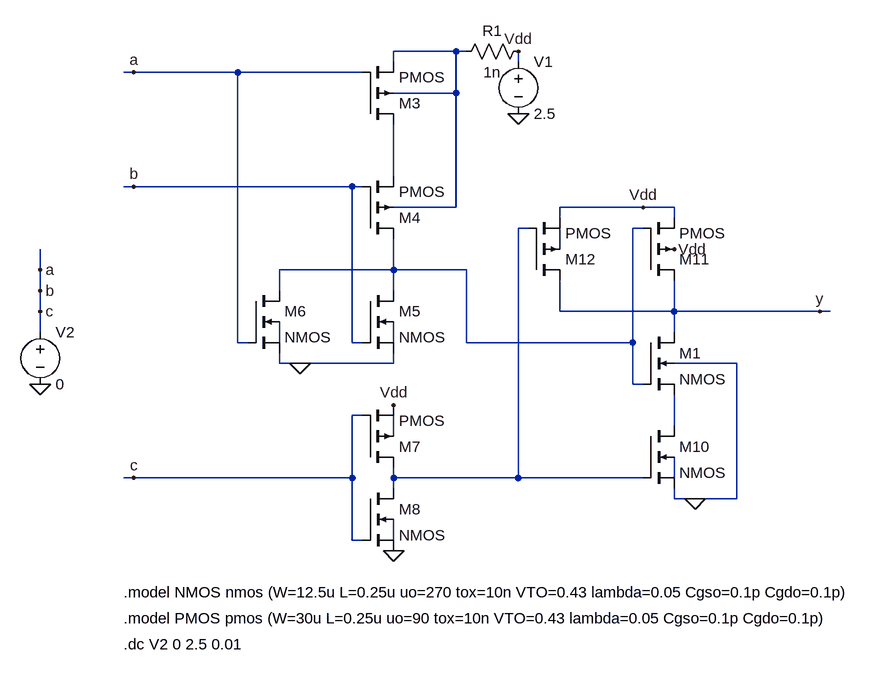
[diagram p0: schematic 1.asc]
1.asc, the LTspice schematic file:
Version 4
SHEET 1 880 680
WIRE -16 -304 -112 -304
WIRE 0 -304 -16 -304
WIRE -112 -288 -112 -304
WIRE 80 -288 80 -304
WIRE -512 -272 -528 -272
WIRE -352 -272 -512 -272
WIRE -160 -272 -352 -272
WIRE -16 -240 -16 -304
WIRE -16 -240 -112 -240
WIRE -112 -112 -112 -192
WIRE -512 -96 -528 -96
WIRE -176 -96 -512 -96
WIRE -160 -96 -176 -96
WIRE -16 -64 -16 -240
WIRE -16 -64 -112 -64
WIRE 272 -64 144 -64
WIRE 320 -64 272 -64
WIRE 144 -48 144 -64
WIRE 320 -48 320 -64
WIRE 96 -32 80 -32
WIRE 272 -32 256 -32
WIRE 144 0 144 -32
WIRE -656 32 -656 0
WIRE -112 32 -112 -16
WIRE -112 32 -288 32
WIRE 0 32 -112 32
WIRE -656 64 -656 32
WIRE -288 64 -288 32
WIRE -112 64 -112 32
WIRE -656 96 -656 64
WIRE 144 96 144 48
WIRE 320 96 320 48
WIRE 320 96 144 96
WIRE 544 96 320 96
WIRE 560 96 544 96
WIRE -656 128 -656 96
WIRE 320 128 320 96
WIRE -352 144 -352 -272
WIRE -336 144 -352 144
WIRE -288 144 -288 112
WIRE -176 144 -176 -96
WIRE -160 144 -176 144
WIRE -112 144 -112 112
WIRE 0 144 0 32
WIRE 256 144 256 -32
WIRE 256 144 0 144
WIRE -288 176 -288 160
WIRE -256 176 -288 176
WIRE -112 176 -112 160
WIRE -112 176 -256 176
WIRE 416 176 320 176
WIRE 256 208 256 144
WIRE 272 208 256 208
WIRE -160 256 -176 256
WIRE 320 272 320 224
WIRE -112 288 -112 256
WIRE -512 352 -528 352
WIRE -176 352 -176 256
WIRE -176 352 -512 352
WIRE -112 352 -112 336
WIRE 80 352 80 -32
WIRE 80 352 -112 352
WIRE 272 352 80 352
WIRE 320 352 320 320
WIRE -112 368 -112 352
WIRE 320 384 320 368
WIRE 352 384 320 384
WIRE 416 384 416 176
WIRE 416 384 352 384
WIRE -176 448 -176 352
WIRE -160 448 -176 448
WIRE -112 448 -112 416
FLAG 80 -208 0
FLAG -256 176 0
FLAG 80 -304 Vdd
FLAG -112 240 Vdd
FLAG -112 464 0
FLAG 272 -64 Vdd
FLAG -512 -272 a
FLAG -512 -96 b
FLAG -512 352 c
FLAG 544 96 y
FLAG -656 96 c
FLAG -656 64 b
FLAG -656 208 0
FLAG 320 0 Vdd
FLAG 352 384 0
FLAG -656 32 a
SYMBOL pmos4 -160 -192 M180
SYMATTR InstName M3
SYMBOL pmos4 -160 -16 M180
SYMATTR InstName M4
SYMBOL nmos4 -160 64 R0
SYMATTR InstName M5
SYMBOL nmos4 -336 64 R0
SYMATTR InstName M6
SYMBOL pmos4 -160 336 M180
SYMATTR InstName M7
SYMBOL nmos4 -160 368 R0
SYMATTR InstName M8
SYMBOL nmos4 272 272 R0
SYMATTR InstName M10
SYMBOL pmos4 272 48 M180
SYMATTR InstName M11
SYMBOL pmos4 96 48 M180
SYMATTR InstName M12
SYMBOL voltage 80 -304 R0
WINDOW 123 0 0 Left 2
WINDOW 39 0 0 Left 2
SYMATTR InstName V1
SYMATTR Value 2.5
SYMBOL voltage -656 112 R0
WINDOW 123 0 0 Left 2
WINDOW 39 0 0 Left 2
SYMATTR InstName V2
SYMATTR Value 0
SYMBOL nmos4 272 128 R0
SYMATTR InstName M1
SYMBOL res 96 -320 R90
WINDOW 0 0 56 VBottom 2
WINDOW 3 32 56 VTop 2
SYMATTR InstName R1
SYMATTR Value 1n
TEXT -528 528 Left 2 !.model NMOS nmos (W=12.5u L=0.25u uo=270 tox=10n VTO=0.43 lambda=0.05 Cgso=0.1p Cgdo=0.1p)
TEXT -528 568 Left 2 !.model PMOS pmos (W=30u L=0.25u uo=90 tox=10n VTO=0.43 lambda=0.05 Cgso=0.1p Cgdo=0.1p)
TEXT -528 608 Left 2 !.dc V2 0 2.5 0.01

The netlist it stands for:
* 1.asc
M3 N002 c N001 N001 PMOS
M4 N004 c N002 N001 PMOS
M5 N004 c 0 N007 NMOS
M6 N004 c 0 N006 NMOS
M7 N003 c Vdd N009 PMOS
M8 N003 c 0 N011 NMOS
M10 N008 N003 0 N010 NMOS
M11 y N004 Vdd Vdd PMOS
M12 y N003 Vdd N005 PMOS
V1 Vdd 0 2.5
V2 c 0 0
M1 y N004 N008 0 NMOS
R1 Vdd N001 1n
.model NMOS NMOS
.model PMOS PMOS
.lib standard.mos
.model NMOS nmos (W=12.5u L=0.25u uo=270 tox=10n VTO=0.43 lambda=0.05 Cgso=0.1p Cgdo=0.1p)
.model PMOS pmos (W=30u L=0.25u uo=90 tox=10n VTO=0.43 lambda=0.05 Cgso=0.1p Cgdo=0.1p)
.dc V2 0 2.5 0.01
.backanno
.end

* Results of the author's LTspice run, read from the files saved beside the schematic
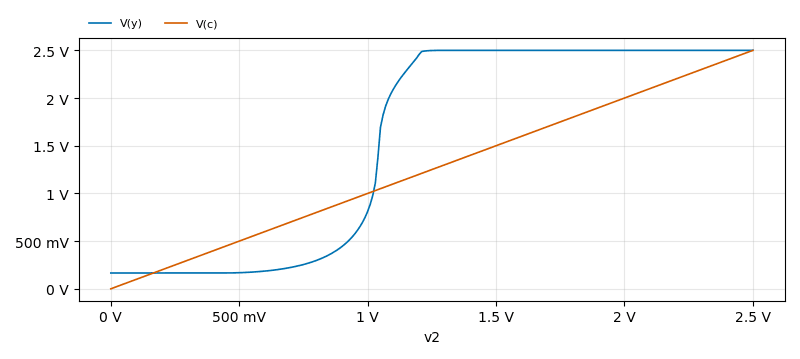
[diagram p1: DC transfer characteristic of 1.asc, plotted from the saved traces]
* DC transfer characteristic, 1 run:
*   V(y): 165.6 mV at v2=0 V, 2.5 V at v2=2.5 V, min 165.6 mV, max 2.5 V
*   V(c): 0 V at v2=0 V, 2.5 V at v2=2.5 V, min 0 V, max 2.5 V